# EAGLE design jtag-20-6 (EAGLE 7.7.0)
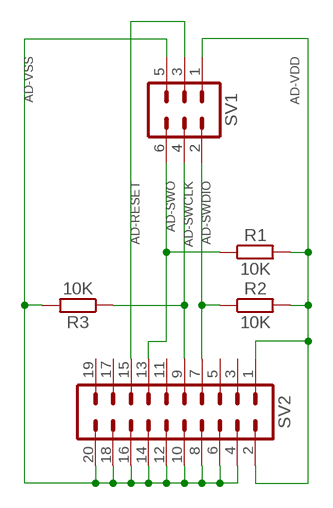
[diagram p0: schematic, sheet 1]

## Parts
R1  10K  R-EU_R1206  [R1206]
R2  10K  R-EU_R1206  [R1206]
R3  10K  R-EU_R1206  [R1206]
SV1  MA03-2  [MA03-2]
SV2  MA10-2  [MA10-2]

## Nets
AD-RESET: SV1.3 SV2.15
AD-SWCLK: R3.1 SV1.4 SV2.9
AD-SWDIO: R2.1 SV1.2 SV2.7
AD-SWO: R1.1 SV1.6 SV2.13
AD-VDD: R1.2 R2.2 SV1.1 SV2.1 SV2.2
AD-VSS: R3.2 SV1.5 SV2.4 SV2.6 SV2.8 SV2.10 SV2.12 SV2.14 SV2.16 SV2.18 SV2.20
Unconnected: SV2.3 SV2.5 SV2.11 SV2.17 SV2.19

## Library data of the parts
R1-R3 = rcl:R-EU_: RESISTOR, European symbol
SV1 = con-lstb:MA03-2: PIN HEADER; OC_FARNELL: unknown; OC_NEWARK: unknown
SV2 = con-lstb:MA10-2: PIN HEADER; OC_FARNELL: unknown; OC_NEWARK: unknown

## Board
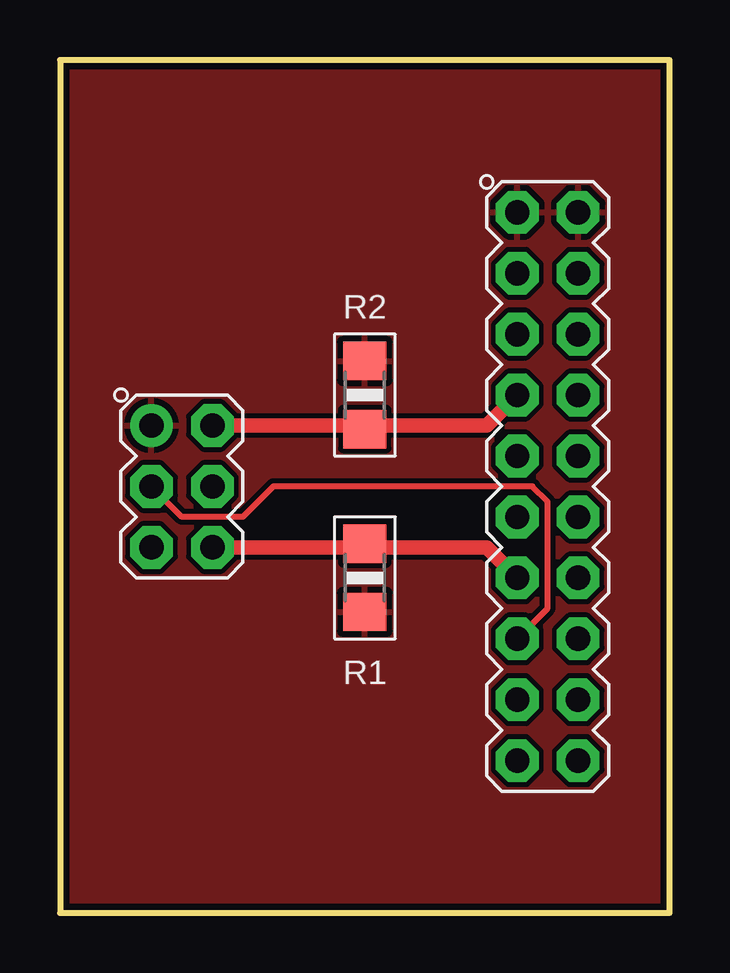
[diagram p1: board, top side]
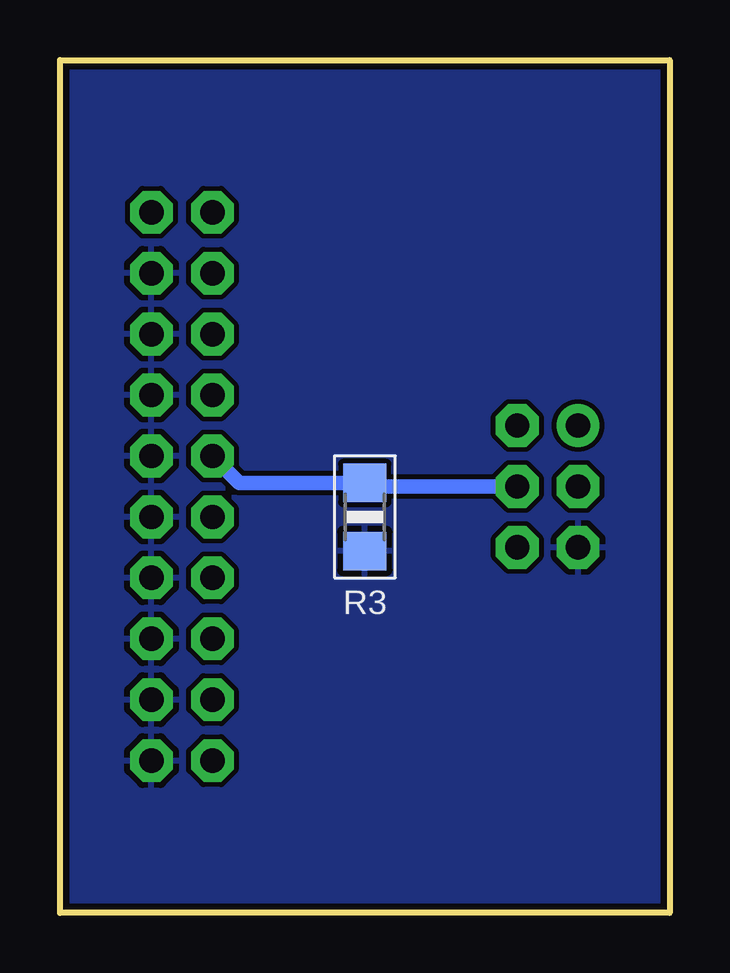
[diagram p2: board, bottom side, seen from below]

Size 25.4 x 35.56 mm. Coordinates in mm from the lower left corner, seen from the top.
Outline: 0,0 25.4,0 25.4,35.56 0,35.56 0,0
Copper layers (1*16): Top 0.035mm / dielectric 1.5mm / Bottom 0.035mm
Design rules "eagle": minimum track width 10mil, minimum drill 19mil, track to track 8mil, track to pad 8mil, pad to pad 7mil, via to via 12mil, smd to smd 7mil, copper to edge 10mil, drill to drill 30mil, minimum pad ring 15mil, minimum via ring 8mil, stop-mask expansion 4mil, vias tented up to drill 0mil, thermal gap 10mil

### Footprints (pad centres in the part's own frame; a part is rotated, then mirrored left to right if it is on the bottom)
R1206 = smd 1.6 x 1.803: 1 -1.422,0; 2 1.422,0
MA03-2 = drill 1.016: 1 -2.54,-1.27 | drill 1.016 octagon: 2 -2.54,1.27; 3 0,-1.27; 4 0,1.27; 5 2.54,-1.27; 6 2.54,1.27
MA10-2 = drill 1.016 octagon: 1 -11.43,-1.27; 2 -11.43,1.27; 3 -8.89,-1.27; 4 -8.89,1.27; 5 -6.35,-1.27; 6 -6.35,1.27; 7 -3.81,-1.27; 8 -3.81,1.27; 9 -1.27,-1.27; 10 -1.27,1.27; 11 1.27,-1.27; 12 1.27,1.27; 13 3.81,-1.27; 14 3.81,1.27; 15 6.35,-1.27; 16 6.35,1.27; 17 8.89,-1.27; 18 8.89,1.27; 19 11.43,-1.27; 20 11.43,1.27

### Placement (x,y rotation side)
R1  12.7,13.97 270 top
R2  12.7,21.59 90 top
R3  12.7,16.51 270 bottom
SV1  5.08,17.78 270 top
SV2  20.32,17.78 270 top

### Tracks (layer width: path | path; a pad name or v marks a point on that pad's centre or on a via)
AD-RESET
  Top 0.254: SV2.15 20.32,12.7 20.32,17.14 19.69,17.78 8.89,17.78 7.62,16.51 5.08,16.51 SV1.3
AD-SWCLK
  Bottom 0.61: SV1.4 12.7,17.78 R3.1 17.93,17.93 SV2.9
AD-SWDIO
  Top 0.61: SV1.2 12.55,20.32 R2.1 12.7,20.32 17.78,20.32 SV2.7
AD-SWO
  Top 0.254: 17.78,15.24 11.58,15.24 R1.1
  Top 0.61: SV1.6 17.78,15.24 SV2.13
AD-VDD
  pour Top: 0,35.56 25.4,35.56 25.4,0 0,0
AD-VSS
  pour Bottom: 0,35.56 0,0 25.4,0 25.4,35.56